# EAGLE design source_eagle (EAGLE 9.6.2)
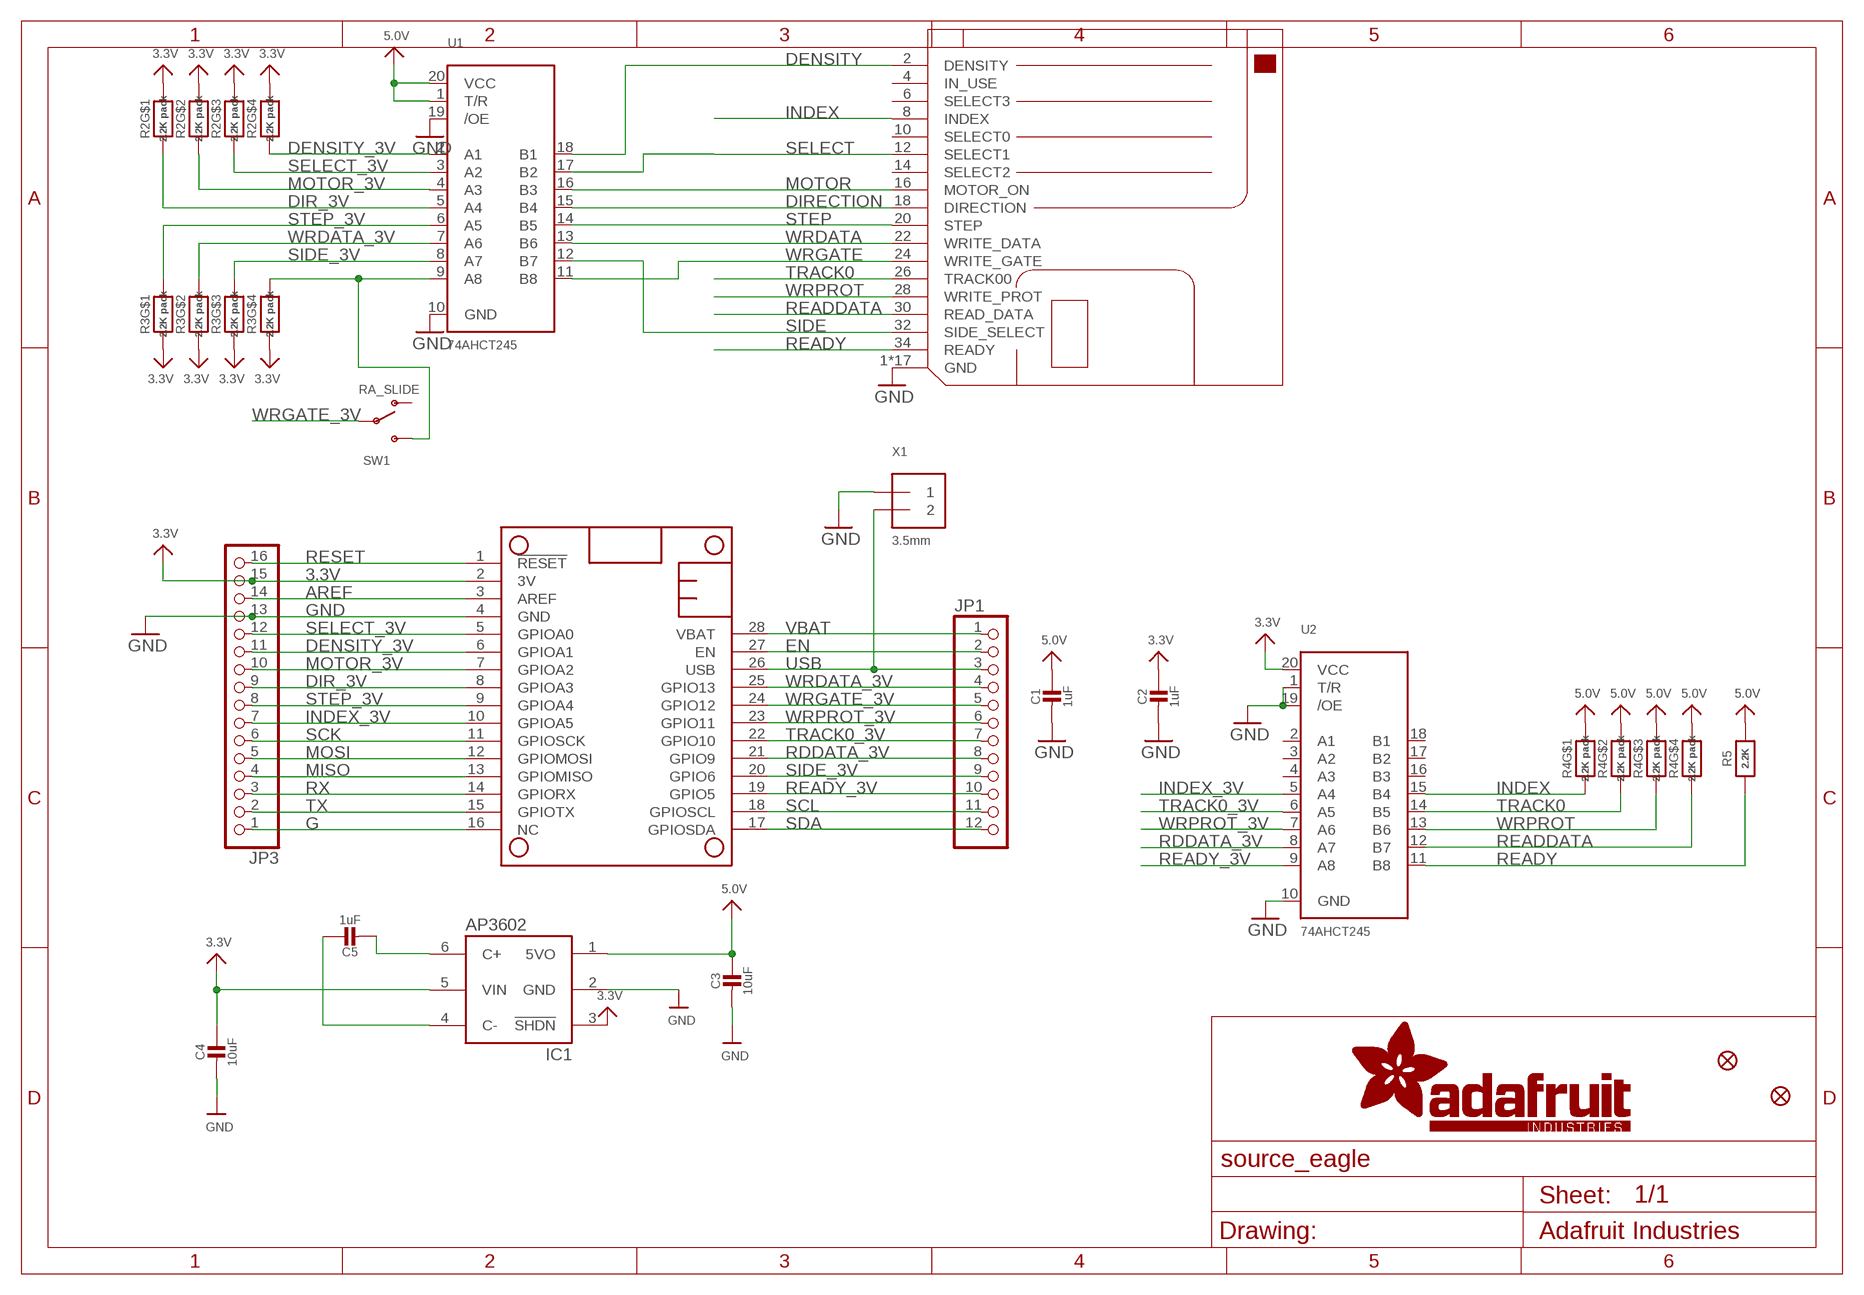
[diagram p0: schematic, sheet 1]

## Parts
C1  1uF  CAP_CERAMIC0603_NO  [0603-NO]
C2  1uF  CAP_CERAMIC0603_NO  [0603-NO]
C3  10uF  CAP_CERAMIC0805-NOOUTLINE  [0805-NO]
C4  10uF  CAP_CERAMIC0805-NOOUTLINE  [0805-NO]
C5  1uF  CAP_CERAMIC0603_NO  [0603-NO]
FDD1  FLOPPY_IDC_SMT  [2X17_FLOPPY_SMTIDC]
FID1  FIDUCIAL_1MM  [FIDUCIAL_1MM]
FID2  FIDUCIAL_1MM  [FIDUCIAL_1MM]
IC1  AP3602  [SOT23-6]
JP1  HEADER-1X12  [1X12_ROUND]
JP3  HEADER-1X16ROUND  [1X16_ROUND]
MS1  FEATHERWING  [FEATHERWING]
R2  2.2K pack  RESISTOR_4PACK  [RESPACK_4X0603]
R3  2.2K pack  RESISTOR_4PACK  [RESPACK_4X0603]
R4  2.2K pack  RESISTOR_4PACK  [RESPACK_4X0603]
R5  2.2K  RESISTOR_0603_NOOUT  [0603-NO]
SW1  RA_SLIDE  SWITCH_SPDT  [SPDT_SMT_SSSS811101]
U1  74AHCT245  74LCX245_SSOP20  [SSOP20]
U2  74AHCT245  74LCX245_SSOP20  [SSOP20]
X1  3.5mm  TERMBLOCK_1X2_3.5MM  [TERMBLOCK_1X2-3.5MM]

## Nets
3.3V: C2.1 C4.1 IC1.3(!SHDN) IC1.5(VIN) JP3.15 MS1.2(3V) R2.5 R2.6 R2.7 R2.8 R3.1 R3.2 R3.3 R3.4 U2.20(VCC)
5.0V: C1.1 C3.1 IC1.1(5VO) R4.5 R4.6 R4.7 R4.8 R5.2 U1.1(T/R) U1.20(VCC)
AREF: JP3.14 MS1.3(AREF)
DENSITY: FDD1.2(DENSITY) U1.18(B1)
DENSITY_3V: JP3.11 MS1.6(GPIOA1) R2.4 U1.2(A1)
DIR_3V: JP3.9 MS1.8(GPIOA3) R2.1 U1.5(A4)
DIRECTION: FDD1.18(DIRECTION) U1.15(B4)
EN: JP1.2 MS1.27(EN)
G: JP3.1 MS1.16(NC)
GND: C1.2 C2.2 C3.2 C4.2 FDD1.1(GND) FDD1.3(GND) FDD1.5(GND) FDD1.7(GND) FDD1.9(GND) FDD1.11(GND) FDD1.13(GND) FDD1.15(GND) FDD1.17(GND) FDD1.19(GND) FDD1.21(GND) FDD1.23(GND) FDD1.25(GND) FDD1.27(GND) FDD1.29(GND) FDD1.31(GND) FDD1.33(GND) IC1.2(GND) JP3.13 MS1.4(GND) U1.10(GND) U1.19(/OE) U2.1(T/R) U2.10(GND) U2.19(/OE) X1.1
INDEX: FDD1.8(INDEX) R4.1 U2.15(B4)
INDEX_3V: JP3.7 MS1.10(GPIOA5) U2.5(A4)
MISO: JP3.4 MS1.13(GPIOMISO)
MOSI: JP3.5 MS1.12(GPIOMOSI)
MOTOR: FDD1.16(MOTOR_ON) U1.16(B3)
MOTOR_3V: JP3.10 MS1.7(GPIOA2) R2.2 U1.4(A3)
N$1: R3.5 SW1.C(S) U1.9(A8)
N$2: C5.2 IC1.6(C+)
N$3: C5.1 IC1.4(C-)
RDDATA_3V: JP1.8 MS1.21(GPIO9) U2.8(A7)
READDATA: FDD1.30(READ_DATA) R4.4 U2.12(B7)
READY: FDD1.34(READY) R5.1 U2.11(B8)
READY_3V: JP1.10 MS1.19(GPIO5) U2.9(A8)
RESET: JP3.16 MS1.1(!RESET)
RX: JP3.3 MS1.14(GPIORX)
SCK: JP3.6 MS1.11(GPIOSCK)
SCL: JP1.11 MS1.18(GPIOSCL)
SDA: JP1.12 MS1.17(GPIOSDA)
SELECT: FDD1.12(SELECT1) U1.17(B2)
SELECT_3V: JP3.12 MS1.5(GPIOA0) R2.3 U1.3(A2)
SIDE: FDD1.32(SIDE_SELECT) U1.12(B7)
SIDE_3V: JP1.9 MS1.20(GPIO6) R3.6 U1.8(A7)
STEP: FDD1.20(STEP) U1.14(B5)
STEP_3V: JP3.8 MS1.9(GPIOA4) R3.8 U1.6(A5)
TRACK0: FDD1.26(TRACK00) R4.2 U2.14(B5)
TRACK0_3V: JP1.7 MS1.22(GPIO10) U2.6(A5)
TX: JP3.2 MS1.15(GPIOTX)
USB: JP1.3 MS1.26(USB) X1.2
VBAT: JP1.1 MS1.28(VBAT)
WRDATA: FDD1.22(WRITE_DATA) U1.13(B6)
WRDATA_3V: JP1.4 MS1.25(GPIO13) R3.7 U1.7(A6)
WRGATE: FDD1.24(WRITE_GATE) U1.11(B8)
WRGATE_3V: JP1.5 MS1.24(GPIO12) SW1.B(P)
WRPROT: FDD1.28(WRITE_PROT) R4.3 U2.13(B6)
WRPROT_3V: JP1.6 MS1.23(GPIO11) U2.7(A6)
Unconnected: FDD1.4(IN_USE) FDD1.6(SELECT3) FDD1.10(SELECT0) FDD1.14(SELECT2) SW1.A(O) U2.2(A1) U2.3(A2) U2.4(A3) U2.16(B3) U2.17(B2) U2.18(B1)

## Library data of the parts
C1-C5 = microbuilder:CAP_CERAMIC: Ceramic Capacitors For new designs, use the packages preceded by an '_' character since they are more reliable: The following footprints should be used on most boards: _0402 - Standard footprint for regular board layouts _0603 - Standard footprint for regular board layouts _0805 - Standard footprint for regular board layouts _1206 - Standard footprint for regular board layouts For extremely tight-pitch boards where space is at a premium, the following 'micro-pitch' footprints can be used (smaller pads, no silkscreen outline, etc.): _0402MP - Micro-pitch footprint for very dense/compact boards _0603MP - Micro-pitch footprint for very dense/compact boards _0805MP - Micro-pitch footprint for very dense/compact boards _1206MP - Micro-pitch footprint for very dense/compact boards
FDD1 = adafruit_electromech:FLOPPY_IDC
FID1 FID2 = microbuilder:FIDUCIAL: Fiducial Alignment Points Various fiducial points for machine vision alignment.; BOM: EXCLUDE
IC1 = microbuilder:AP3602
JP1 = microbuilder:HEADER-1X12
JP3 = microbuilder:HEADER-1X16: PIN HEADER
MS1 = microbuilder:FEATHERWING
R2-R4 = microbuilder:RESISTOR_4PACK: Resistor Packs (4 resistors) 4 x 0603 10K 1/16W - Digikey: YC164J-10KCT-ND
R5 = microbuilder:RESISTOR: Resistors For new designs, use the packages preceded by an '_' character since they are more reliable: The following footprints should be used on most boards: _0402 - Standard footprint for regular board layouts _0603 - Standard footprint for regular board layouts _0805 - Standard footprint for regular board layouts _1206 - Standard footprint for regular board layouts For extremely tight-pitch boards where space is at a premium, the following 'micro-pitch' footprints can be used (smaller pads, no silkscreen outline, etc.): _0402MP - Micro-pitch footprint for very dense/compact boards _0603MP - Micro-pitch footprint for very dense/compact boards _0805MP - Micro-pitch footprint for very dense/compact boards _1206MP - Micro-pitch footprint for very dense/compact boards
SW1 = adafruit_electromech:SWITCH_SPDT: Switch - SPDT SSSS811101 - Horizontal Two Position SMT, 0.3A 4V [Mouser: 688-SSSS811101]
U1 U2 = microbuilder:74LCX245: 74LCX245MTC - 5.0V Tolerant Bi-Directional Buffer Can be used to interface 5.0V logic to 2.5 or 3.3V devices Digikey: 74LCX245MTCXTR-ND Mouser: 512-74LCX245MTCX
X1 = adafruit_electromech:TERMBLOCK_1X2: 3.5mm Terminal block http://www.ladyada.net/library/pcb/eaglelibrary.html

## Board
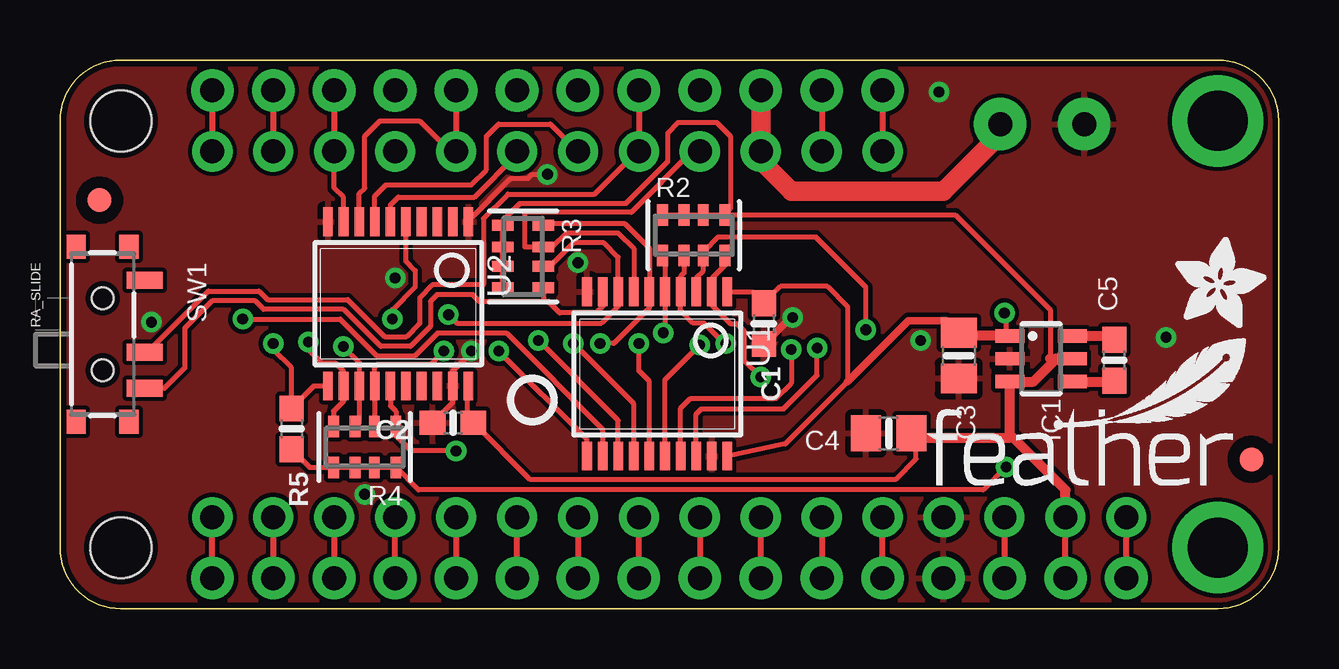
[diagram p1: board, top side]
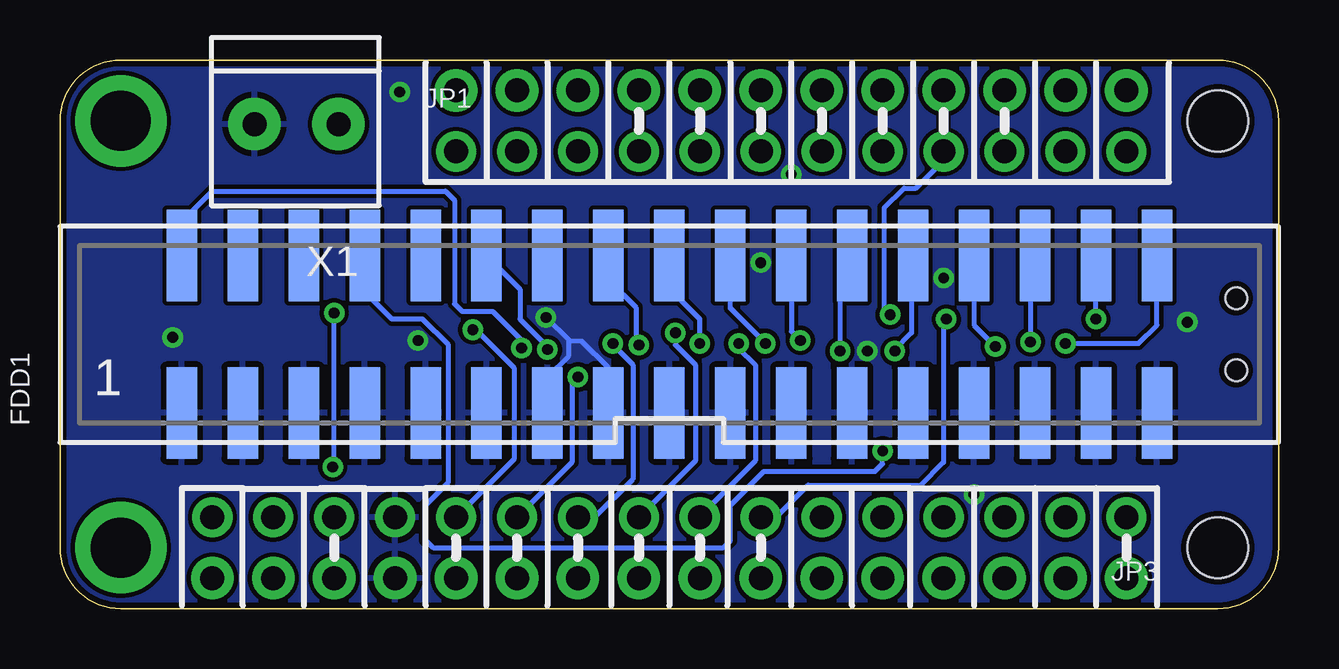
[diagram p2: board, bottom side, seen from below]

Size 50.8 x 22.86 mm. Coordinates in mm from the lower left corner, seen from the top.
Outline: 48.26,22.86 2.54,22.86 arc90 0,20.32 0,2.54 arc90 2.54,0 48.26,0 arc90 50.8,2.54 50.8,20.32 arc90 48.26,22.86
Copper layers (1*16): Top 0.035mm / dielectric 1.5mm / Bottom 0.035mm
Design rules "adafruit 7-7": minimum track width 7mil, minimum drill 15.5mil, track to track 7mil, track to pad 7mil, pad to pad 7mil, via to via 7mil, smd to smd 7mil, copper to edge 10mil, drill to drill 8mil, minimum pad ring 7mil, minimum via ring 8mil, stop-mask expansion 2mil, vias tented up to drill 20mil, thermal gap 10mil

### Footprints (pad centres in the part's own frame; a part is rotated, then mirrored left to right if it is on the bottom)
0603-NO = smd 1.075 x 1: 1 -0.85,0; 2 0.85,0
0805-NO = smd 1.24 x 1.5: 1 -0.95,0; 2 0.95,0
2X17_FLOPPY_SMTIDC = smd 3.81 x 1.27: 1 -3.278,20.32; 2 3.278,20.32; 3 -3.278,17.78; 4 3.278,17.78; 5 -3.278,15.24; 6 3.278,15.24; 7 -3.278,12.7; 8 3.278,12.7; 9 -3.278,10.16; 10 3.278,10.16; 11 -3.278,7.62; 12 3.278,7.62; 13 -3.278,5.08; 14 3.278,5.08; 15 -3.278,2.54; 16 3.278,2.54; 17 -3.278,0; 18 3.278,0; 19 -3.278,-2.54; 20 3.278,-2.54; 21 -3.278,-5.08; 22 3.278,-5.08; 23 -3.278,-7.62; 24 3.278,-7.62; 25 -3.278,-10.16; 26 3.278,-10.16; 27 -3.278,-12.7; 28 3.278,-12.7; 29 -3.278,-15.24; 30 3.278,-15.24; 31 -3.278,-17.78; 32 3.278,-17.78; 33 -3.278,-20.32; 34 3.278,-20.32
FIDUCIAL_1MM = smd 1 x 1: 1 0,0
SOT23-6 = smd 0.55 x 1.2: 1 -0.95,-1.3; 2 0,-1.3; 3 0.95,-1.3; 4 0.95,1.3; 5 0,1.3; 6 -0.95,1.3
1X12_ROUND = drill 1 pad 1.676: 1 -13.97,0; 2 -11.43,0; 3 -8.89,0; 4 -6.35,0; 5 -3.81,0; 6 -1.27,0; 7 1.27,0; 8 3.81,0; 9 6.35,0; 10 8.89,0; 11 11.43,0; 12 13.97,0
1X16_ROUND = drill 1 pad 1.676: 1 -19.05,0; 2 -16.51,0; 3 -13.97,0; 4 -11.43,0; 5 -8.89,0; 6 -6.35,0; 7 -3.81,0; 8 -1.27,0; 9 1.27,0; 10 3.81,0; 11 6.35,0; 12 8.89,0; 13 11.43,0; 14 13.97,0; 15 16.51,0; 16 19.05,0
FEATHERWING = drill 1 pad 1.778: 1 6.35,1.27; 2 8.89,1.27; 3 11.43,1.27; 4 13.97,1.27; 5 16.51,1.27; 6 19.05,1.27; 7 21.59,1.27; 8 24.13,1.27; 9 26.67,1.27; 10 29.21,1.27; 11 31.75,1.27; 12 34.29,1.27; 13 36.83,1.27; 14 39.37,1.27; 15 41.91,1.27; 16 44.45,1.27; 17 44.45,21.59; 18 41.91,21.59; 19 39.37,21.59; 20 36.83,21.59; 21 34.29,21.59; 22 31.75,21.59; 23 29.21,21.59; 24 26.67,21.59; 25 24.13,21.59; 26 21.59,21.59; 27 19.05,21.59; 28 16.51,21.59 | drill 2.5 pad 3.81: P$1 2.54,20.32; P$2 2.54,2.54 | hole 2.54: 48.26,20.32; 48.26,2.54
RESPACK_4X0603 = smd 0.45 x 0.9: 1 -1.3,-0.85; 2 -0.4,-0.85; 3 0.4,-0.85; 4 1.3,-0.85; 5 1.3,0.85; 6 0.4,0.85; 7 -0.4,0.85; 8 -1.3,0.85
SPDT_SMT_SSSS811101 = smd 0.7 x 1.5: A -2.25,1.242; B 0.75,1.242; C 2.25,1.242 | smd 1 x 0.8: SUP1 -3.65,0.592; SUP2 -3.65,-1.608; SUP3 3.65,0.592; SUP4 3.65,-1.608 | hole 0.9: -1.5,-0.508; 1.5,-0.508
SSOP20 = smd 0.4 x 1.2: 1 -2.925,-3.42; 2 -2.275,-3.42; 3 -1.625,-3.42; 4 -0.975,-3.42; 5 -0.325,-3.42; 6 0.325,-3.42; 7 0.975,-3.42; 8 1.625,-3.42; 9 2.275,-3.42; 10 2.925,-3.42; 11 2.925,3.42; 12 2.275,3.42; 13 1.625,3.42; 14 0.975,3.42; 15 0.325,3.42; 16 -0.325,3.42; 17 -0.975,3.42; 18 -1.625,3.42; 19 -2.275,3.42; 20 -2.925,3.42
TERMBLOCK_1X2-3.5MM = drill 1 pad 2.184: 1 1.8,0; 2 -1.7,0

### Placement (x,y rotation side)
C1  29.34,11.87 270 top
C2  16.38,7.75 180 top
C3  37.47,10.54 270 top
C4  34.54,7.3 180 top
C5  43.94,10.35 90 top
FDD1  25.4,11.43 90 bottom
FID1  1.65,17.02 0 top
FID2  49.66,6.22 0 top
IC1  40.89,10.41 270 top
JP1  20.32,19.05 0 bottom
JP3  25.4,3.81 180 bottom
MS1  50.8,0 0 bottom
PLABEL0  [PLABEL0]  26.92,17.53 0 top
PLABEL1  [PLABEL1]  24.26,17.53 0 top
PLABEL2  [PLABEL2]  19.05,17.53 0 top
PLABEL3  [PLABEL3]  21.59,17.53 0 top
PLABEL4  [PLABEL4]  16.64,17.53 0 top
PLABEL5  [PLABEL5]  13.97,17.53 0 top
PLABEL6  [PLABEL6]  11.43,17.53 0 top
PLABEL7  [PLABEL7]  24.45,5.27 0 top
PLABEL8  [PLABEL8]  26.48,5.21 0 top
PLABEL9  [PLABEL9]  29.21,5.33 0 top
PLABEL10  [PLABEL10]  34.54,5.46 0 top
PLABEL11  [PLABEL11]  21.4,5.21 0 top
PLABEL12  [PLABEL12]  31.88,5.46 0 top
PLABEL13  [PLABEL13]  31.37,12.83 0 top
PLABEL14  [PLABEL14]  5.27,11.37 90 top
PLABEL15  [PLABEL15]  45.09,2.27 0 bottom
PLABEL16  [PLABEL16]  42.85,2.27 0 bottom
PLABEL17  [PLABEL17]  37.86,2.27 0 bottom
PLABEL18  [PLABEL18]  32.32,20 0 bottom
PLABEL19  [PLABEL19]  35.05,20 0 bottom
PLABEL20  [PLABEL20]  29.88,20 0 bottom
PLABEL21  [PLABEL21]  6.73,20 0 bottom
PLABEL22  [PLABEL22]  9.33,20 0 bottom
PLABEL23  [PLABEL23]  9.53,2.29 0 bottom
PLABEL24  [PLABEL24]  11.94,2.29 0 bottom
PLABEL25  [PLABEL25]  14.48,2.22 0 bottom
PLABEL26  [PLABEL26]  17.14,2.29 0 bottom
PLABEL27  [PLABEL27]  19.63,2.27 0 bottom
PLABEL28  [PLABEL28]  46.86,16.26 90 bottom
PLABEL29  [PLABEL29]  3.05,16.32 90 bottom
PLABEL30  [PLABEL30]  2.79,4.89 90 bottom
PLABEL31  [PLABEL31]  35.94,16.89 90 bottom
PLABEL32  [PLABEL32]  44.83,18.54 90 bottom
PLABEL33  [PLABEL33]  46.74,5.78 90 bottom
PLABEL34  [PLABEL34]  0.19,2.98 90 bottom
PLABEL35  [PLABEL35]  0.32,16.26 90 bottom
R2  26.42,15.56 0 top
R3  19.3,14.67 270 top
R4  12.7,6.73 180 top
R5  9.65,7.49 270 top
SW1  2.29,11.43 270 top
U1  24.89,9.78 180 top
U2  14.1,12.7 180 top
U$26  [PCBFEAT-REV-040]  19.68,8.7 0 top
U$27  [FEATHERLOGO_SMALL]  36.07,5.08 0 top
U$28  [ADAFRUIT_3.5MM]  46.48,11.68 0 top
X1  40.89,20.19 180 bottom

### Tracks (layer width: path | path; a pad name or v marks a point on that pad's centre or on a via)
3.3V
  Top 0.203: U2.20 16.98,9.24 16.98,8 C2.1 19.58,5.4 34.86,5.4 35.69,6.23 35.69,7.11 | R3.4 R3.3 R3.2 R3.1 18.45,16.17 19.18,16.89 23.59,16.89 25.34,18.64 25.34,19.81 25.78,20.26 27.37,20.26 27.94,19.68 27.94,16.66 27.69,16.41 | R2.8 R2.7 R2.6 27.69,16.41 | 27.69,16.41 R2.5 37.31,16.41 41.27,12.45 41.27,10.41
  Top 0.254: MS1.2 JP3.15
  Top 0.406: JP3.15 41.91,4.95 39.75,7.11 39.56,7.11 | 41.53,10.41 40.58,9.46 IC1.3 39.59,7.15 39.56,7.11 | 41.27,10.41 41.53,10.41 | 41.53,10.41 IC1.5 | C4.1 35.68,7.11 35.69,7.11 39.56,7.11
5.0V  (via drill 0.45)
  Top 0.203: U1.1 28.86,13.2 C1.1 30.04,13.42 31.98,13.42 32.83,12.57 32.83,9.46 30.23,6.86 U1.20 | R5.2 10.41,5.88 R4.5 R4.6 R4.7 R4.8 14.93,4.95 38.48,4.95 v39.43,5.91 | v39.37,12.32 39.43,12.26 39.43,11.36
  Top 0.305: C3.1 36.96,12 35.37,12 32.83,9.46
  Top 0.406: IC1.1 39.43,11.36 37.59,11.36 C3.1
  Bottom 0.203: v39.37,12.32 39.37,5.91 v39.43,5.91
AREF
  Top 0.254: JP3.14 MS1.3
DENSITY  (via drill 0.45)
  Top 0.203: U1.18 26.52,8.1 26.73,8.32 30.16,8.32 31.56,9.72 v31.56,10.86
  Bottom 0.203: FDD1.2 45.72,16.13 44.45,17.4 34.73,17.4 34.35,17.02 34.35,12.7 34.04,12.38 32.77,12.38 31.4,11.02 v31.56,10.86
DENSITY_3V  (via drill 0.45)
  Top 0.203: R2.4 27.72,14.31 27.17,13.76 U1.2 27.18,12.69 27.18,12.64 27.94,11.87 28.21,11.87 28.51,11.58 28.51,10.35 v29.21,9.65
  Top 0.254: JP3.11 MS1.6
  Bottom 0.203: v29.21,9.65 29.46,9.4 29.46,6.1 JP3.11
DIR_3V  (via drill 0.45)
  Top 0.203: R2.1 25.22,14.61 U1.5 25.22,11.49 v25.15,11.49
  Top 0.254: JP3.9 MS1.8
  Bottom 0.203: v25.15,11.49 25.15,10.99 24.32,10.16 24.32,6.16 JP3.9
DIRECTION  (via drill 0.45)
  Top 0.203: U1.15 24.57,9.47 24.13,9.91 v24.13,11.05
  Bottom 0.203: v24.13,11.05 24.13,12.06 25.4,13.34 FDD1.18
EN
  Top 0.254: MS1.27 JP1.2
G
  Top 0.254: MS1.16 JP3.1
GND  (via drill 0.45)
  Top 0.203: C2.2 16.37,8.59 U2.19 16.37,9.89 17.14,10.67 v17.14,10.73 | v30.54,12.13 30.44,12.13 30.38,12.06 | U2.1 17.02,16.16 18.79,17.93 19.51,17.93 19.68,18.1 v20.32,18.1
  Top 0.305: 30.38,12.06 C1.2
  Bottom 0.203: FDD1.13 30.48,9.65 29.59,10.54 29.59,11.18 | 29.59,11.18 v30.54,12.13 | 29.59,11.18 29.56,11.14 29.05,11.14 27.94,10.03 FDD1.15
  other vias: 3.81,11.94 35.88,11.18 46.1,11.3 36.64,21.53 21.59,14.41 12.7,4.76 13.97,13.78
  pour Top: 50.8,22.86 0,22.86 0,0 50.8,0
  pour Bottom: 50.8,22.86 0,22.86 0,0 50.8,0
INDEX  (via drill 0.45)
  Top 0.203: U2.15 13.77,8.44 14,8.22 R4.1 14,7.21 14.64,6.57 v16.51,6.57
  Bottom 0.203: FDD1.8 38.1,13.21 36.96,12.06 35.69,12.06 34.61,10.99 34.61,5.27 35.56,4.32 35.56,2.86 35.24,2.54 23.14,2.54 22.86,2.82 22.86,4.32 21.46,5.71 16.83,5.71 16.51,6.03 v16.51,6.57
INDEX_3V  (via drill 0.45)
  Top 0.203: v13.86,12.06 13.86,12.46 14.8,13.41 14.8,14.09 14.42,14.47 U2.5
  Top 0.254: JP3.7 MS1.10
  Bottom 0.203: JP3.7 20.95,3.81 19.62,5.14 14.92,5.14 13.97,6.1 13.97,11.95 v13.86,12.06
MISO
  Top 0.254: MS1.13 JP3.4
MOSI
  Top 0.254: JP3.5 MS1.12
MOTOR  (via drill 0.45)
  Top 0.203: U1.16 25.22,9.53 v26.67,10.99
  Bottom 0.203: v26.67,10.99 26.8,11.11 26.8,12.55 27.94,13.69 FDD1.16
MOTOR_3V  (via drill 0.45)
  Top 0.203: R2.2 26.02,13.99 25.87,13.85 U1.4 25.87,12.42 26.39,11.9 26.84,11.9 27.69,11.05 v27.75,11.05
  Top 0.254: MS1.7 JP3.10
  Bottom 0.203: JP3.10 28.51,3.81 26.92,5.4 26.92,10.16 27.75,10.99 v27.75,11.05
N$1
  Top 0.203: R3.5 20.15,12.8 | 20.15,12.8 20.34,12.8 20.35,12.8 20.83,12.32 22.35,12.32 22.62,12.58 U1.9 | 20.15,12.8 17.49,12.8 17.2,13.08 15.71,13.08 15.44,12.8 15.44,11.76 14.61,10.93 13.37,10.93 11.82,12.47 8.48,12.47 8.13,12.83 6.35,12.83 5.21,11.68 5.21,10.03 4.35,9.18 SW1.C
N$2
  Top 0.406: IC1.6 43.85,11.36 C5.2
N$3
  Top 0.406: IC1.4 43.77,9.46 C5.1
RDDATA_3V
  Top 0.203: U2.8 12.47,17.3 12.7,17.53 12.7,19.68 13.34,20.32 14.99,20.32 16.26,19.05 JP1.8
  Top 0.254: MS1.21 JP1.8
READDATA  (via drill 0.45)
  Top 0.203: R4.4 11.4,8.22 11.82,8.65 U2.12 11.82,9.89 11.49,10.22 10.92,10.22 10.41,10.73 10.41,11.05 v10.35,11.11
  Bottom 0.203: FDD1.30 10.35,14.52 v10.35,11.11
READY  (via drill 0.45)
  Top 0.203: U2.11 10.59,9.28 R5.1 9.65,10.03 8.89,10.79 v8.89,11.05
  Bottom 0.203: v8.89,11.05 5.84,11.05 5.08,11.81 FDD1.34
READY_3V
  Top 0.203: U2.9 11.82,17.13 11.43,17.53 JP1.10
  Top 0.254: MS1.19 JP1.10
RESET
  Top 0.254: MS1.1 JP3.16
RX
  Top 0.254: JP3.3 MS1.14
SCK
  Top 0.254: MS1.11 JP3.6
SCL
  Top 0.254: MS1.18 JP1.11
SDA
  Top 0.254: MS1.17 JP1.12
SELECT  (via drill 0.45)
  Top 0.203: U1.17 25.87,8.34 26.29,8.76 29.84,8.76 30.48,9.4 v30.48,10.79
  Bottom 0.203: FDD1.12 31.62,13.31 31.62,12.06 30.48,10.92 v30.48,10.79
SELECT_3V  (via drill 0.45)
  Top 0.203: U1.3 26.52,13.79 26.82,14.08 R2.3 26.82,14.88 27.43,15.49 31.5,15.49 33.59,13.4 v33.59,11.62
  Top 0.254: MS1.5 JP3.12
  Bottom 0.203: v33.59,11.62 33.47,11.62 31.88,10.03 31.88,6.22 JP3.12
SIDE  (via drill 0.45)
  Top 0.203: v7.62,12.06 11.68,12.06 13.2,10.54 14.81,10.54 15.76,11.49 18.61,11.49 22.62,7.48 U1.12
  Bottom 0.203: v7.62,12.06 FDD1.32
SIDE_3V  (via drill 0.45)
  Top 0.203: v16.2,12.25 16.55,11.9 22.57,11.9 23.27,12.6 U1.8 23.27,14.64 22.67,15.24 21.4,15.24 20.43,14.27 R3.6
  Bottom 0.203: v16.2,12.25 16.45,12.51 16.45,16.7 15.62,17.53 15.11,17.53 13.97,18.67 JP1.9
  Bottom 0.254: MS1.20 JP1.9
STEP  (via drill 0.45)
  Top 0.203: U1.14 23.92,8.53 v21.4,11.05
  Bottom 0.203: FDD1.20 22.86,12.51 v21.4,11.05
STEP_3V  (via drill 0.45)
  Top 0.203: v22.51,11.05 23.08,11.05 24.57,12.53 U1.6 24.57,15.02 23.56,16.03 20.22,16.03 R3.8
  Top 0.254: MS1.9 JP3.8
  Bottom 0.203: JP3.8 24.13,3.84 21.81,6.16 21.81,10.16 22.51,10.86 v22.51,11.05
TRACK0  (via drill 0.45)
  Top 0.203: R4.2 13.12,7.6 U2.14 13.12,10.07 13.21,10.16 15.43,10.16 v16,10.73
  Bottom 0.203: v16,10.73 16,10.79 15.3,11.49 15.3,14.64 FDD1.26
TRACK0_3V
  Top 0.203: U2.6 13.77,16.82 14.1,17.14 17.27,17.14 19.05,18.92 JP1.7
  Bottom 0.254: JP1.7 MS1.22
TX
  Top 0.254: JP3.2 MS1.15
USB
  Top 0.813: MS1.26 JP1.3 29.21,18.67 30.48,17.4 36.83,17.4 39.19,19.76 X1.2
VBAT
  Top 0.254: MS1.28 JP1.1
WRDATA  (via drill 0.45)
  Top 0.203: U1.13 23.27,7.85 v19.94,11.18
  Bottom 0.203: FDD1.22 20.32,11.56 v19.94,11.18
WRDATA_3V
  Top 0.203: JP1.4 26.35,19.05 23.81,16.51 19.37,16.51 19.37,15.07 R3.7 20.54,15.07 21.11,15.64 23.29,15.64 23.92,15.01 U1.7
  Bottom 0.254: MS1.25 JP1.4
WRGATE  (via drill 0.45)
  Top 0.203: U1.11 21.97,7.05 v18.29,10.73
  Bottom 0.203: v18.29,10.73 18.29,14.2 FDD1.24
WRGATE_3V
  Top 0.203: JP1.5 24.07,19.05 22.29,17.27 18.67,17.27 17.65,16.26 17.65,13.49 15.52,13.49 14.99,12.96 14.99,11.89 14.44,11.33 13.54,11.33 11.99,12.88 8.65,12.88 8.3,13.23 6.18,13.23 3.63,10.68 SW1.B
  Top 0.254: MS1.24 JP1.5
WRPROT  (via drill 0.45)
  Top 0.203: R4.3 12.47,7.75 U2.13 12.47,10.26 v11.81,10.92
  Bottom 0.203: FDD1.28 12.7,11.81 v11.81,10.92
WRPROT_3V
  Top 0.203: U2.7 13.12,17.19 13.59,17.65 17.14,17.65 17.78,18.29 17.78,19.68 18.29,20.19 20.45,20.19 JP1.6
  Bottom 0.254: JP1.6 MS1.23

### Text on the board
Pinguin_tBackup: Ch | Sid | RD | Trk | Pr | WG | WD | Adafruit Floppy / FeatherWing | Write Enable | Idx | Stp | Dir | En | Den | Sel
Pinguin_bBackup: sda | scl | usb | en | bat | GND | USB5V | NoWr | 34 | 2 | WrOK | 33 | 1 | tx | rx | mi | mo | sck | gnd | 3vo | rst